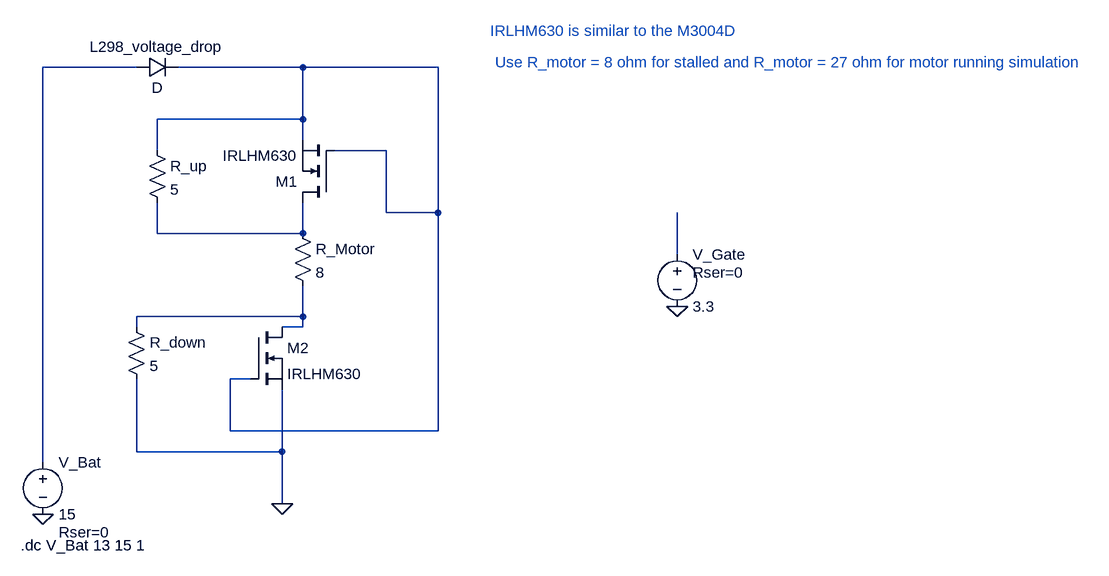
[diagram p0: schematic Current_Limiter_spice_model.asc]
Current_Limiter_spice_model.asc, the LTspice schematic file:
Version 4
SHEET 1 1688 680
WIRE 144 -496 0 -496
WIRE 400 -496 208 -496
WIRE 608 -496 400 -496
WIRE 400 -416 400 -496
WIRE 400 -416 176 -416
WIRE 400 -384 400 -416
WIRE 176 -368 176 -416
WIRE 528 -368 448 -368
WIRE 528 -272 528 -368
WIRE 608 -272 608 -496
WIRE 608 -272 528 -272
WIRE 176 -240 176 -288
WIRE 400 -240 400 -288
WIRE 400 -240 176 -240
WIRE 976 -208 976 -272
WIRE 400 -112 400 -160
WIRE 400 -112 144 -112
WIRE 144 -96 144 -112
WIRE 400 -96 400 -112
WIRE 400 -96 368 -96
WIRE 320 -16 288 -16
WIRE 288 64 288 -16
WIRE 608 64 608 -272
WIRE 608 64 288 64
WIRE 144 96 144 -16
WIRE 368 96 368 0
WIRE 368 96 144 96
WIRE 0 112 0 -496
WIRE 368 176 368 96
FLAG 368 176 0
FLAG 976 -128 0
FLAG 0 192 0
SYMBOL voltage 0 96 R0
WINDOW 123 0 0 Left 0
WINDOW 39 24 124 Left 2
SYMATTR InstName V_Bat
SYMATTR Value 15
SYMATTR SpiceLine Rser=0
SYMBOL nmos 448 -288 R180
SYMATTR InstName M1
SYMATTR Value IRLHM630
SYMBOL nmos 320 -96 R0
SYMATTR InstName M2
SYMATTR Value IRLHM630
SYMBOL voltage 976 -224 R0
WINDOW 123 0 0 Left 0
WINDOW 39 24 44 Left 2
SYMATTR InstName V_Gate
SYMATTR Value 3.3
SYMATTR SpiceLine Rser=0
SYMBOL res 384 -256 R0
SYMATTR InstName R_Motor
SYMATTR Value 8
SYMBOL res 128 -112 R0
SYMATTR InstName R_down
SYMATTR Value 5
SYMBOL res 160 -384 R0
SYMATTR InstName R_up
SYMATTR Value 5
SYMBOL diode 144 -480 R270
WINDOW 0 32 32 VTop 2
WINDOW 3 0 32 VBottom 2
SYMATTR InstName L298_voltage_drop
TEXT -34 240 Left 2 !.dc V_Bat 13 15 1
TEXT 688 -552 Left 2 ;IRLHM630 is similar to the M3004D
TEXT 696 -504 Left 2 ;Use R_motor = 8 ohm for stalled and R_motor = 27 ohm for motor running simulation

The netlist it stands for:
* Current_Limiter_spice_model.asc
V_Bat N001 0 15 Rser=0
M1 N003 N002 N002 N002 IRLHM630
M2 N005 N002 0 0 IRLHM630
V_Gate N004 0 3.3 Rser=0
R_Motor N003 N005 8
R_down N005 0 5
R_up N002 N003 5
D§L298_voltage_drop N001 N002 D
.model D D
.lib standard.dio
.model NMOS NMOS
.model PMOS PMOS
.lib standard.mos
.dc V_Bat 13 15 1
* IRLHM630 is similar to the M3004D
* Use R_motor = 8 ohm for stalled and R_motor = 27 ohm for motor running simulation
.backanno
.end